# EAGLE design topboard (EAGLE 6.2)
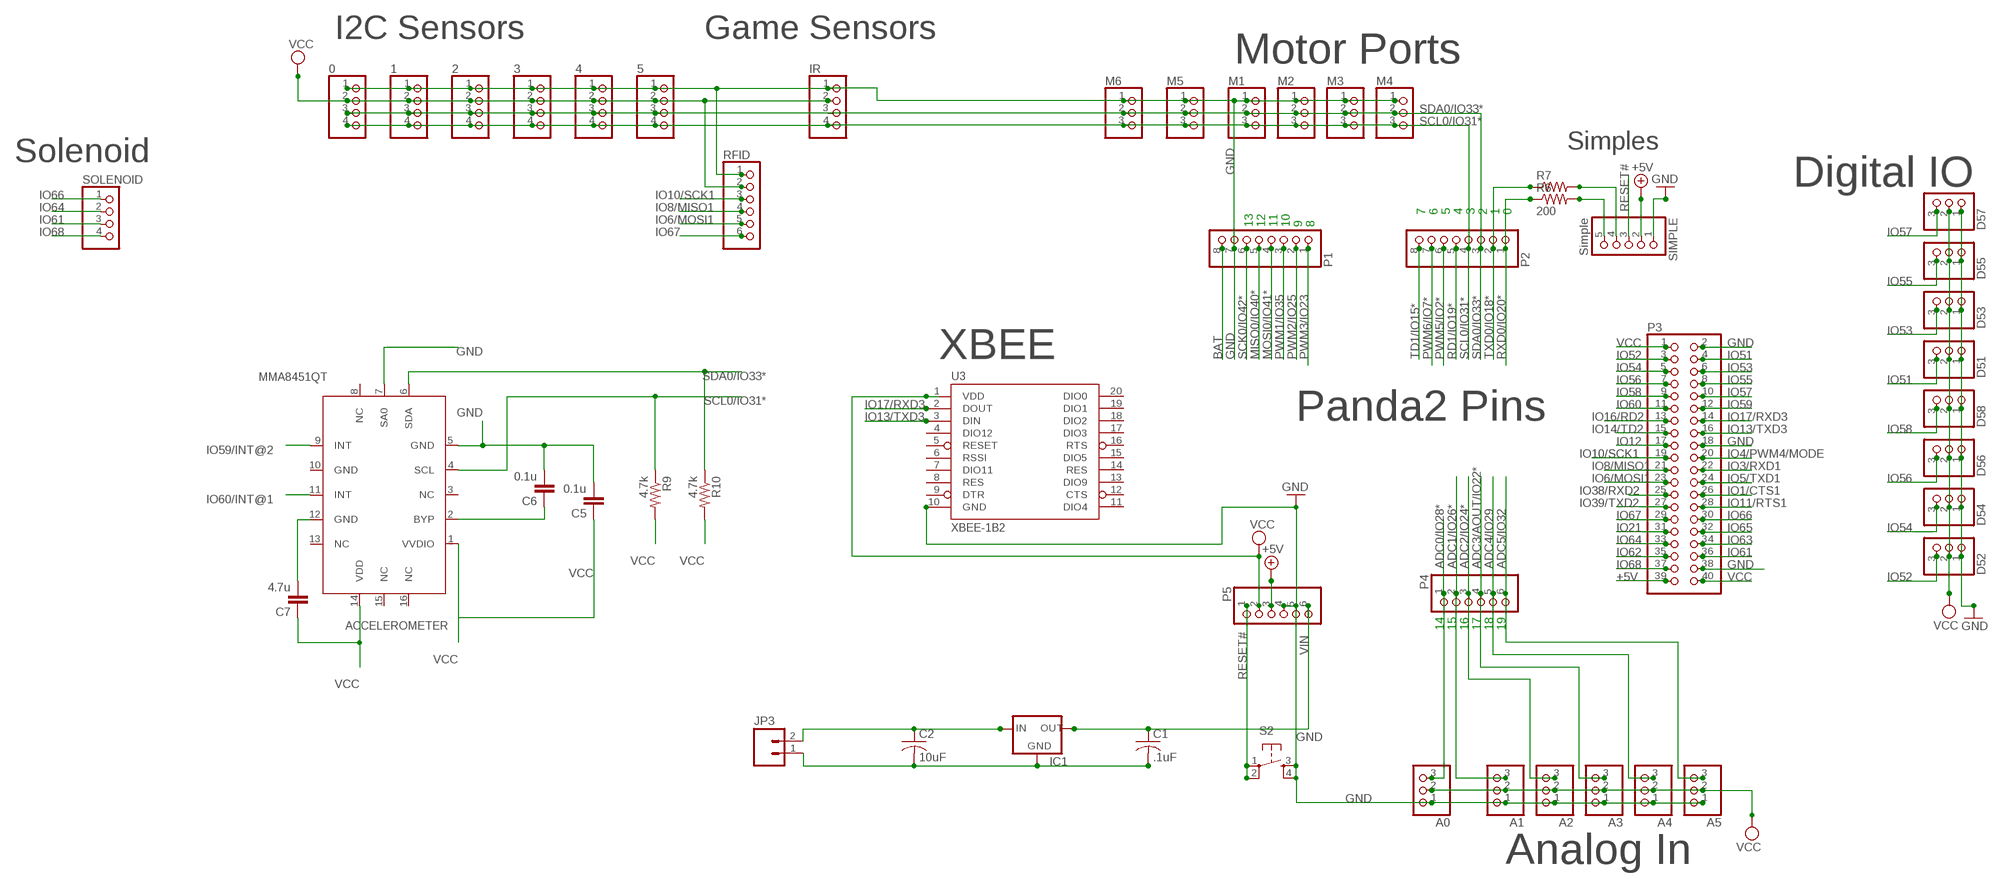
[diagram p0: schematic, sheet 1, part 1 of 2]
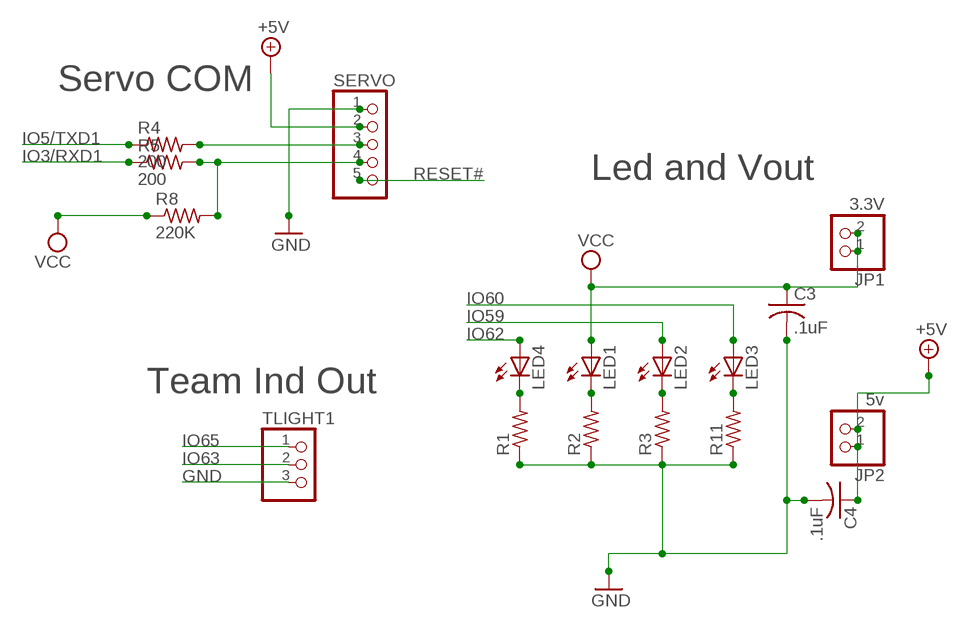
[diagram p1: schematic, sheet 1, part 2 of 2]

## Parts
0  PINHD-1X04_2.54-S  [1X04-S]
1  PINHD-1X04_2.54-S  [1X04-S]
2  PINHD-1X04_2.54-S  [1X04-S]
3  PINHD-1X04_2.54-S  [1X04-S]
4  PINHD-1X04_2.54-S  [1X04-S]
5  PINHD-1X04_2.54-S  [1X04-S]
A0  PINHD-1X03_2.54-S  [1X03-S]
A1  PINHD-1X03_2.54-S  [1X03-S]
A2  PINHD-1X03_2.54-S  [1X03-S]
A3  PINHD-1X03_2.54-S  [1X03-S]
A4  PINHD-1X03_2.54-S  [1X03-S]
A5  PINHD-1X03_2.54-S  [1X03-S]
ACCELEROMETER  MMA8451QT  [MMA8451QT]
C1  .1uF  C-USC0603  [C0603]
C2  10uF  C-USC0805  [C0805]
C3  .1uF  C-USC0603K  [C0603K]
C4  .1uF  C-USC0603K  [C0603K]
C5  0.1u  CAP0603-CAP  [0603-CAP]
C6  0.1u  CAP0603-CAP  [0603-CAP]
C7  4.7u  CAP0603-CAP  [0603-CAP]
D51  PINHD-1X03_2.54-S  [1X03-S]
D52  PINHD-1X03_2.54-S  [1X03-S]
D53  PINHD-1X03_2.54-S  [1X03-S]
D54  PINHD-1X03_2.54-S  [1X03-S]
D55  PINHD-1X03_2.54-S  [1X03-S]
D56  PINHD-1X03_2.54-S  [1X03-S]
D57  PINHD-1X03_2.54-S  [1X03-S]
D58  PINHD-1X03_2.54-S  [1X03-S]
IC1  V_REG_78XXSIDE  [78XXL]
IR  PINHD-1X04_2.54-S  [1X04-S]
JP1  3.3V  PINHD-1X2  [1X02]
JP2  5v  PINHD-1X2  [1X02]
JP3  M02PTH4  [1X02_XTRA_BIG]
LED1  LED0603  [LED-0603]
LED2  LED0603  [LED-0603]
LED3  LED0603  [LED-0603]
LED4  LED0603  [LED-0603]
M1  PINHD-1X03_2.54-S  [1X03-S]
M2  PINHD-1X03_2.54-S  [1X03-S]
M3  PINHD-1X03_2.54-S  [1X03-S]
M4  PINHD-1X03_2.54-S  [1X03-S]
M5  PINHD-1X03_2.54-S  [1X03-S]
M6  PINHD-1X03_2.54-S  [1X03-S]
P1  PINHD-1X08_2.54-S  [1X08-S]
P2  PINHD-1X08_2.54-S  [1X08-S]
P3  PINHD-2X20  [2X20]
P4  PINHD-1X06_2.54-S  [1X06-S]
P5  PINHD-1X06_2.54-S  [1X06-S]
R1  R-US_R0603  [R0603]
R2  R-US_R0603  [R0603]
R3  R-US_R0603  [R0603]
R4  200  R-US_R0603  [R0603]
R5  200  R-US_R0603  [R0603]
R6  200  R-US_R0603  [R0603]
R7  R-US_R0603  [R0603]
R8  220K  R-US_R0603  [R0603]
R9  4.7k  RESISTOR0603-RES  [0603-RES]
R10  4.7k  RESISTOR0603-RES  [0603-RES]
R11  R-US_R0603  [R0603]
RFID  PINHD-1X6  [1X06]
S2  TAC_SWITCHPTH  [TACTILE-PTH]
SERVO  PINHD-1X05_2.54-S  [1X05-S]
SIMPLE  Simple  PINHD-1X05_2.54-S  [1X05-S]
SOLENOID  PINHD-1X4  [1X04]
TLIGHT1  PINHD-1X03_2.54-S  [1X03-S]
U3  XBEE-1B2  [XBEE-SILK]

## Nets
12V: C2.1 IC1.IN JP3.2
+5V [power]: C4.1 JP2.1 JP2.2 P3.39 P5.3 SERVO.2 SIMPLE.2
ADC0/IO28*: A0.3 P4.1
ADC1/IO26*: A1.3 P4.2
ADC2/IO24*: A2.3 P4.3
ADC3/AOUT/IO22*: A3.3 P4.4
ADC4/IO29: A4.3 P4.5
ADC5/IO32: A5.3 P4.6
BAT: P1.8
GND: 0.1 1.1 2.1 3.1 4.1 5.1 A0.1 A1.1 A2.1 A3.1 A4.1 A5.1 ACCELEROMETER.5(GND) ACCELEROMETER.7(SA0) C1.2 C2.2 C3.2 C4.2 C5.2 C6.2 D51.1 D52.1 D53.1 D54.1 D55.1 D56.1 D57.1 D58.1 IC1.GND IC1.P$1(GND) IC1.P$2(GND) IR.1 JP3.1 M1.1 M2.1 M3.1 M4.1 M5.1 M6.1 P1.7 P3.2 P3.18 P3.38 P5.4 P5.5 R1.1 R2.1 R3.1 R11.1 RFID.1 S2.3 S2.4 SERVO.1 SIMPLE.1 TLIGHT1.3 U3.10(GND)
IO1/CTS1: P3.26
IO3/RXD1: P3.22 R5.1
IO4/PWM4/MODE: P3.20
IO5/TXD1: P3.24 R4.1
IO6/MOSI1: P3.23 RFID.5
IO8/MISO1: P3.21 RFID.4
IO10/SCK1: P3.19 RFID.3
IO11/RTS1: P3.28
IO12: P3.17
IO13/TXD3: P3.16 U3.3(DIN)
IO14/TD2: P3.15
IO16/RD2: P3.13
IO17/RXD3: P3.14 U3.2(DOUT)
IO21: P3.31
IO38/RXD2: P3.25
IO39/TXD2: P3.27
IO51: D51.3 P3.4
IO52: D52.3 P3.3
IO53: D53.3 P3.6
IO54: D54.3 P3.5
IO55: D55.3 P3.8
IO56: D56.3 P3.7
IO57: D57.3 P3.10
IO58: D58.3 P3.9
IO59: LED2.A P3.12
IO59/INT@2: ACCELEROMETER.9(INT)
IO60: LED3.A P3.11
IO60/INT@1: ACCELEROMETER.11(INT)
IO61: P3.36 SOLENOID.3
IO62: LED4.A P3.35
IO63: P3.34 TLIGHT1.2
IO64: P3.33 SOLENOID.2
IO65: P3.32 TLIGHT1.1
IO66: P3.30 SOLENOID.1
IO67: P3.29 RFID.6
IO68: P3.37 SOLENOID.4
MISO0/IO40*: P1.5
MOSI0/IO41*: P1.4
N$1: LED4.C R1.2
N$2: LED1.C R2.2
N$3: LED2.C R3.2
N$4: R6.2 SIMPLE.5
N$5: R4.2 SERVO.3
N$6: R7.2 SIMPLE.4
N$7: R5.2 R8.2 SERVO.4
N$8: LED3.C R11.2
N$9: ACCELEROMETER.12(GND) C7.2
N$10: ACCELEROMETER.2(BYP) C6.1
PWM1/IO35: P1.3
PWM2/IO25: P1.2
PWM3/IO23: P1.1
PWM5/IO2*: P2.6
PWM6/IO7*: P2.7
RD1/IO19*: P2.5
RESET#: P5.1 S2.1 S2.2 SERVO.5 SIMPLE.3
RXD0/IO20*: P2.1 R6.1
SCK0/IO42*: P1.6
SCL0/IO31*: 0.4 1.4 2.4 3.4 4.4 5.4 ACCELEROMETER.4(SCL) IR.4 M1.3 M2.3 M3.3 M4.3 M5.3 M6.3 P2.4 R9.1
SDA0/IO33*: 0.3 1.3 2.3 3.3 4.3 5.3 ACCELEROMETER.6(SDA) IR.3 M1.2 M2.2 M3.2 M4.2 M5.2 M6.2 P2.3 R10.1
TD1/IO15*: P2.8
TXD0/IO18*: P2.2 R7.1
VCC [power]: 0.2 1.2 2.2 3.2 4.2 5.2 A0.2 A1.2 A2.2 A3.2 A4.2 A5.2 ACCELEROMETER.1(VVDIO) ACCELEROMETER.14(VDD) C3.1 C5.1 C7.1 D51.2 D52.2 D53.2 D54.2 D55.2 D56.2 D57.2 D58.2 IR.2 JP1.1 JP1.2 LED1.A P3.1 P3.40 P5.2 R8.1 R9.2 R10.2 RFID.2 U3.1(VDD)
VIN: C1.1 IC1.OUT P5.6
Unconnected: ACCELEROMETER.3(NC) ACCELEROMETER.8(NC) ACCELEROMETER.10(GND) ACCELEROMETER.13(NC) ACCELEROMETER.15(NC) ACCELEROMETER.16(NC) U3.4(DIO12) U3.5(RESET) U3.6(RSSI) U3.7(DIO11) U3.8(RES) U3.9(DTR) U3.11(DIO4) U3.12(CTS) U3.13(DIO9) U3.14(RES) U3.15(DIO5) U3.16(RTS) U3.17(DIO3) U3.18(DIO2) U3.19(DIO1) U3.20(DIO0)

## Notes on the sheet
- I2C Sensors | Game Sensors
- Motor Ports
- Simples
- Solenoid
- Digital IO
- 7 | 6 | 5 | 4 | 3 | 2 | 1 | 0
- 13 | 12 | 11 | 10 | 9 | 8 | Servo COM
- Led and Vout
- XBEE
- Panda2 Pins
- Team Ind Out
- 14 | 15 | 16 | 17 | 18 | 19
- Analog In

## Library data of the parts
0 1-5 IR = pinhead-2:PINHD-1X04: PIN HEADER
A0 A1-A5 D51-D58 M1-M6 TLIGHT1 = pinhead-2:PINHD-1X03: PIN HEADER
ACCELEROMETER = MMA8451QT:MMA8451QT
C1-C4 = rcl:C-US: CAPACITOR, American symbol
C5-C7 = SparkFun:CAP: Capacitor Standard 0603 ceramic capacitor, and 0.1" leaded capacitor.
IC1 = SparkFun:V_REG_78XX: Voltage Regulator Standard 7805 5V regulator. IGO (Input Ground Output). Spark Fun Electronics SKU : COM-00107
JP1 JP2 = pinhead:PINHD-1X2: PIN HEADER
JP3 = SparkFun:M02: Header 2 Standard 2-pin 0.1" header. Use with straight break away headers (SKU : PRT-00116), right angle break away headers (PRT-00553), swiss pins (PRT-00743), machine pins (PRT-00117), and female headers (PRT-00115). Molex polarized connector foot print use with SKU : PRT-08233 with associated crimp pins and housings.
LED1-LED4 = SparkFun:LED: LEDs Standard schematic elements and footprints for 5mm, 3mm, 1206, and 0603 sized LEDs. 5mm - Spark Fun Electronics SKU : COM-00529 (and others)
P1 P2 = pinhead-2:PINHD-1X08: PIN HEADER
P3 = pinhead:PINHD-2X20: PIN HEADER
P4 P5 = pinhead-2:PINHD-1X06: PIN HEADER
R1-R8 R11 = rcl:R-US_: RESISTOR, American symbol
R9 R10 = SparkFun:RESISTOR: Resistor Basic schematic elements and footprints for 0603, 1206, and PTH resistors.
RFID = pinhead:PINHD-1X6: PIN HEADER
S2 = SparkFun:TAC_SWITCH: Momentary Switch Button commonly used for reset or general input. Spark Fun Electronics SKU : COM-00097
SERVO SIMPLE = pinhead-2:PINHD-1X05: PIN HEADER
SOLENOID = pinhead:PINHD-1X4: PIN HEADER
U3 = SparkFun:XBEE-1

## Net classes
1 power: width 0.406 mm, drill 0.381 mm, clearance 0.203 mm

## Board
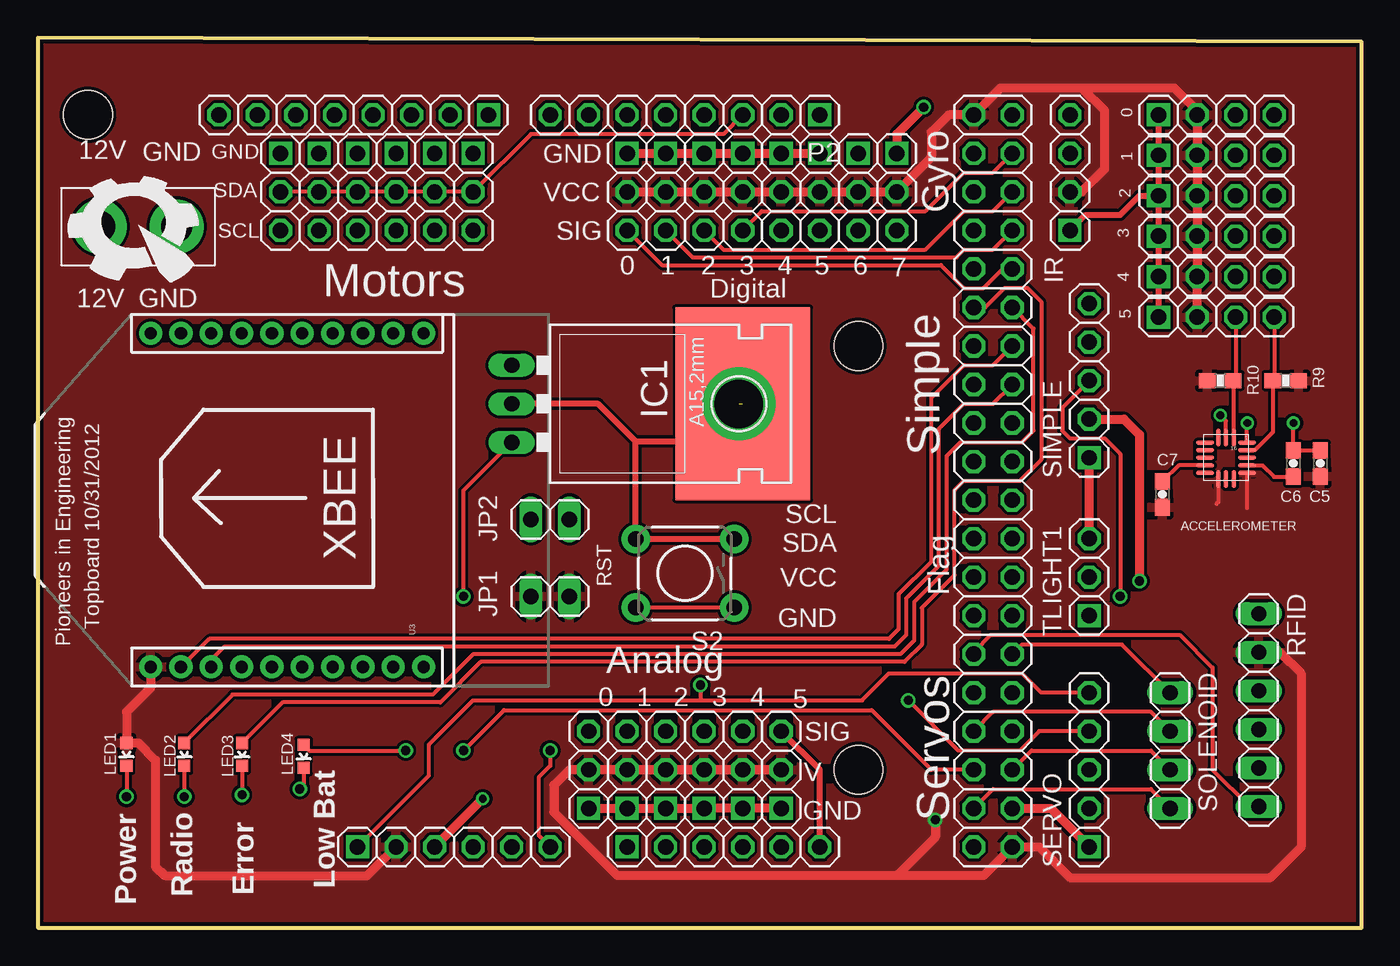
[diagram p2: board, top side]
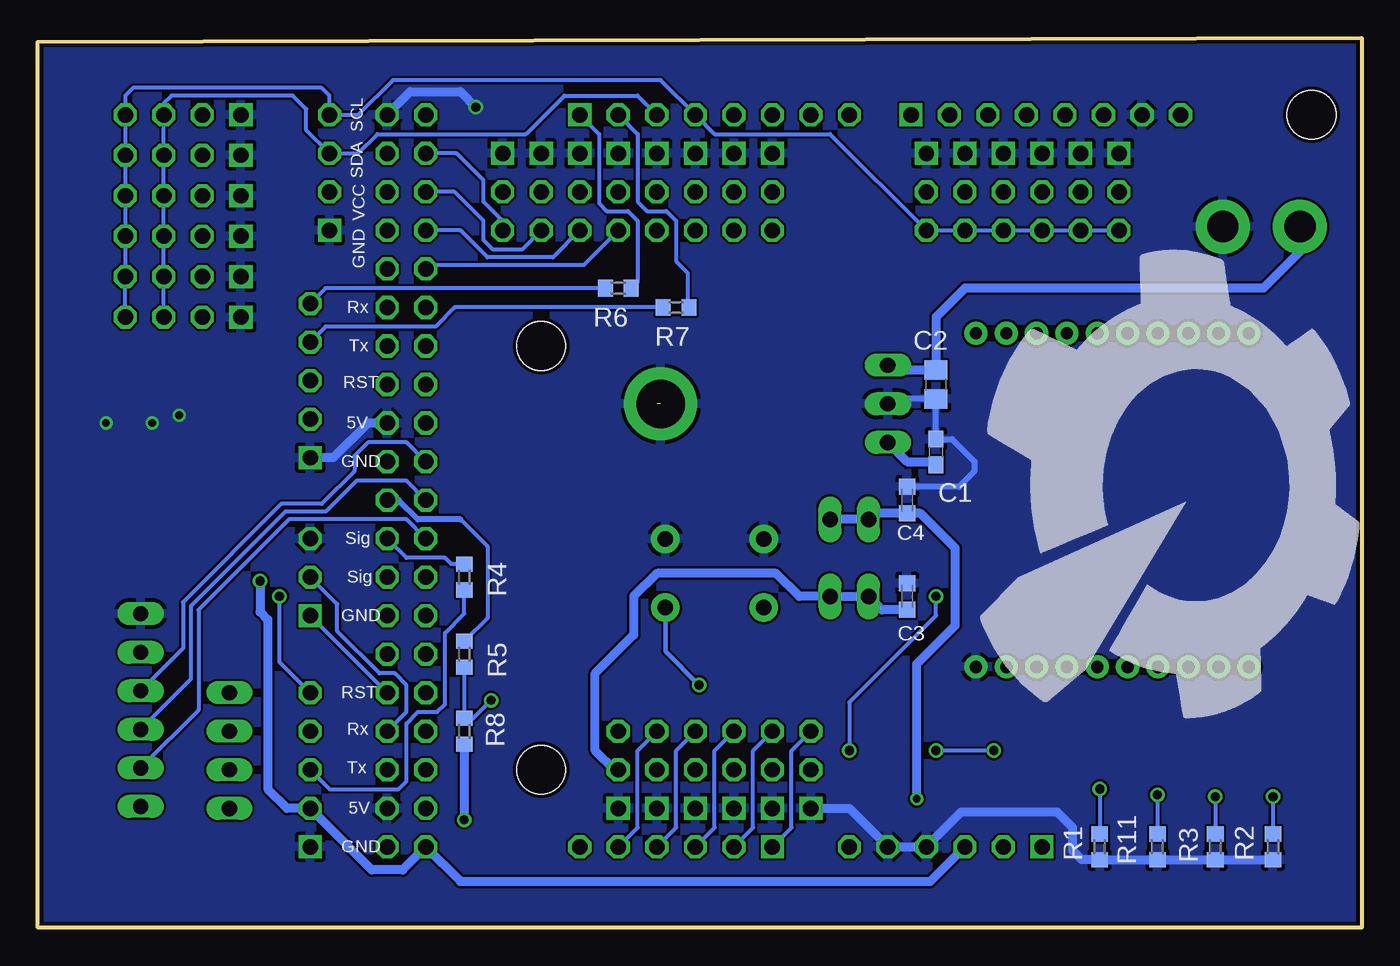
[diagram p3: board, bottom side, seen from below]

Size 87.3 x 58.66 mm. Coordinates in mm from the lower left corner, seen from the top.
Outline: 0,0 87.3,0 87.3,58.41 0,58.66 0,0
Copper layers (1*16): Top 2mil / dielectric 9mil / Bottom 2mil
Design rules: minimum track width 6mil, minimum drill 15mil, track to track 6mil, track to pad 10mil, pad to pad 6mil, via to via 6mil, smd to smd 6mil, copper to edge 10mil, drill to drill 7mil, minimum pad ring 7mil, minimum via ring 7mil, stop-mask expansion 3mil, vias tented up to drill 0mil, thermal gap 10mil
Holes 3.2 mm at 3.3,53.59 54.1,38.35 54.1,10.41

### Footprints (pad centres in the part's own frame; a part is rotated, then mirrored left to right if it is on the bottom)
1X04-S = drill 1.016 square: 1 -3.81,0 | drill 1.016 octagon: 2 -1.27,0; 3 1.27,0; 4 3.81,0
1X03-S = drill 1.016 square: 1 -2.54,0 | drill 1.016 octagon: 2 0,0; 3 2.54,0
MMA8451QT = smd 1.177 x 0.25: 1 -1.38,1; 2 -1.38,0.5; 3 -1.38,0; 4 -1.38,-0.5; 5 -1.38,-1; 9 1.395,-1; 10 1.395,-0.5; 11 1.395,0; 12 1.395,0.5; 13 1.395,1 | smd 0.3 x 1.177: 6 -0.5,-1.341; 7 0,-1.341; 8 0.5,-1.341; 14 0.5,1.405; 15 0,1.405; 16 -0.5,1.405
C0603 = smd 1.1 x 1: 1 -0.85,0; 2 0.85,0
C0805 = smd 1.3 x 1.5: 1 -0.95,0; 2 0.95,0
C0603K = smd 1.05 x 1.08: 1 -0.875,0; 2 0.875,0
0603-CAP = smd 1.1 x 1: 1 -0.85,0; 2 0.85,0
78XXL = drill 1.016 long: GND 0,-3.81; IN -2.54,-3.81; OUT 2.54,-3.81 | smd 12.7 x 8.89: P$1 0,11.43 | drill 3.2: P$2 0,11.176
1X02 = drill 1.016 long: 1 -1.27,0; 2 1.27,0
1X02_XTRA_BIG = drill 2.057 pad 3.556: 1 -2.54,0; 2 2.54,0
LED-0603 = smd 0.8 x 0.8: A 0,-0.75; C 0,0.75
1X08-S = drill 1.016 square: 1 -8.89,0 | drill 1.016 octagon: 2 -6.35,0; 3 -3.81,0; 4 -1.27,0; 5 1.27,0; 6 3.81,0; 7 6.35,0; 8 8.89,0
2X20 = drill 1.016 octagon: 1 -24.13,-1.27; 2 -24.13,1.27; 3 -21.59,-1.27; 4 -21.59,1.27; 5 -19.05,-1.27; 6 -19.05,1.27; 7 -16.51,-1.27; 8 -16.51,1.27; 9 -13.97,-1.27; 10 -13.97,1.27; 11 -11.43,-1.27; 12 -11.43,1.27; 13 -8.89,-1.27; 14 -8.89,1.27; 15 -6.35,-1.27; 16 -6.35,1.27; 17 -3.81,-1.27; 18 -3.81,1.27; 19 -1.27,-1.27; 20 -1.27,1.27; 21 1.27,-1.27; 22 1.27,1.27; 23 3.81,-1.27; 24 3.81,1.27; 25 6.35,-1.27; 26 6.35,1.27; 27 8.89,-1.27; 28 8.89,1.27; 29 11.43,-1.27; 30 11.43,1.27; 31 13.97,-1.27; 32 13.97,1.27; 33 16.51,-1.27; 34 16.51,1.27; 35 19.05,-1.27; 36 19.05,1.27; 37 21.59,-1.27; 38 21.59,1.27; 39 24.13,-1.27; 40 24.13,1.27
1X06-S = drill 1.016 square: 1 -6.35,0 | drill 1.016 octagon: 2 -3.81,0; 3 -1.27,0; 4 1.27,0; 5 3.81,0; 6 6.35,0
R0603 = smd 1 x 1.1: 1 -0.85,0; 2 0.85,0
0603-RES = smd 1.1 x 1: 1 -0.85,0; 2 0.85,0
1X06 = drill 1.016 long: 1 -6.35,0; 2 -3.81,0; 3 -1.27,0; 4 1.27,0; 5 3.81,0; 6 6.35,0
TACTILE-PTH = drill 1.016 pad 1.88: 1 -3.251,2.261; 2 3.251,2.261; 3 -3.251,-2.261; 4 3.251,-2.261
1X05-S = drill 1.016 square: 1 -5.08,0 | drill 1.016 octagon: 2 -2.54,0; 3 0,0; 4 2.54,0; 5 5.08,0
1X04 = drill 1.016 long: 1 -3.81,0; 2 -1.27,0; 3 1.27,0; 4 3.81,0
XBEE-SILK = drill 0.8 pad 1.524: 1 -11,20; 2 -11,18; 3 -11,16; 4 -11,14; 5 -11,12; 6 -11,10; 7 -11,8; 8 -11,6; 9 -11,4; 10 -11,2; 11 11,2; 12 11,4; 13 11,6; 14 11,8; 15 11,10; 16 11,12; 17 11,14; 18 11,16; 19 11,18; 20 11,20

### Placement (x,y rotation side)
0  77.72,53.59 0 top
1  77.72,50.93 0 top
2  77.72,48.26 0 top
3  77.72,45.59 0 top
4  77.72,42.93 0 top
5  77.72,40.26 0 top
A0  36.32,10.41 90 top
A1  38.86,10.41 90 top
A2  41.4,10.41 90 top
A3  43.94,10.41 90 top
A4  46.48,10.41 90 top
A5  49.02,10.41 90 top
ACCELEROMETER  78.36,30.99 180 top
C1  28.07,31.37 90 bottom
C2  28.07,35.81 270 bottom
C3  29.97,21.84 90 bottom
C4  29.97,28.19 90 bottom
C5  84.58,30.61 90 top
C6  82.8,30.61 90 top
C7  74.17,28.57 90 top
D51  46.48,48.51 270 top
D52  56.64,48.51 270 top
D53  43.94,48.51 270 top
D54  54.1,48.51 270 top
D55  41.4,48.51 270 top
D56  51.56,48.51 270 top
D57  38.86,48.51 270 top
D58  49.02,48.51 270 top
IC1  35.05,34.54 270 top
IR  68.07,49.78 90 top
JP1  33.78,21.84 0 top
JP2  33.78,26.92 0 top
JP3  6.6,46.23 180 top
LED1  5.84,11.43 180 top
LED2  9.65,11.43 180 top
LED3  13.46,11.43 180 top
LED4  17.53,11.3 180 top
M1  21.08,48.51 270 top
M2  23.62,48.51 270 top
M3  26.16,48.51 270 top
M4  28.7,48.51 270 top
M5  18.54,48.51 270 top
M6  16,48.51 270 top
P1  20.83,53.59 180 top
P2  42.67,53.59 180 top
P3  62.99,29.46 270 top
P4  45.21,5.33 0 top
P5  27.43,5.33 0 top
R1  17.27,5.33 90 bottom
R2  5.84,5.33 90 bottom
R3  9.65,5.33 90 bottom
R4  59.18,23.11 270 bottom
R5  59.18,18.03 270 bottom
R6  49.02,42.16 180 bottom
R7  45.21,40.89 180 bottom
R8  59.18,12.95 90 bottom
R9  82.3,36.07 0 top
R10  77.98,36.07 180 top
R11  13.46,5.33 90 bottom
RFID  80.52,14.35 270 top
S2  42.67,23.37 180 top
SERVO  69.34,10.41 90 top
SIMPLE  69.34,36.07 90 top
SOLENOID  74.68,11.68 270 top
TLIGHT1  69.34,23.11 90 top
U3  27.43,28.19 90 top
U$2  [PIE-LOGO]  11.81,28.19 270 bottom
U$3  [PIE-LOGO-SMALL]  6.6,46.35 0 top

### Tracks (layer width: path | path; a pad name or v marks a point on that pad's centre or on a via)
12V
  Bottom 0.61: IC1.IN 30.92,36.76 C2.1 28.07,40.26 26.16,42.16 6.48,42.16 4.06,44.58 JP3.2
+5V  (via drill 0.51, 0.6 pad 0.25)
  Top 0.61: SIMPLE.2 71.63,33.53 72.64,32.51 v72.64,22.86 | v29.34,8.51 P5.3
  Bottom 0.61: JP2.2 JP2.1 32.12,27.32 C4.1 29.1,27.32 26.8,25.02 26.8,19.94 29.34,17.4 v29.34,8.51 | v72.64,22.86 72.64,20.83 72.14,20.32 72.14,9.14 70.87,7.87 SERVO.2 65.28,3.81 63.25,3.81 P3.39 59.44,3.05 28.45,3.05 P5.3
ADC0/IO28*
  Bottom 0.254: P4.1 37.59,6.6 37.59,11.68 A0.3
ADC1/IO26*
  Bottom 0.254: P4.2 40.13,6.6 40.13,11.68 A1.3
ADC2/IO24*
  Bottom 0.254: P4.3 42.67,6.6 42.67,11.68 A2.3
ADC3/AOUT/IO22*
  Bottom 0.254: P4.4 45.21,6.6 45.21,11.68 A3.3
ADC4/IO29
  Bottom 0.254: P4.5 47.75,6.6 47.75,11.68 A4.3
ADC5/IO32
  Top 0.406: P4.6 51.56,10.41 A5.3
GND  (via drill 0.51, 0.6 pad 0.25)  (1 unrouted)
  Top 0.254: C5.2 C6.2 v82.8,33.27 | ACCELEROMETER.7 78.36,33.4 v77.98,33.78 | ACCELEROMETER.5 79.74,33.26 v79.76,33.27
  Top 0.406: 39.42,32.08 S2.4 S2.3 | 39.42,32.08 36.96,34.54 IC1.GND | 39.42,32.08 43.76,32.08 IC1.P$2 | IR.1 69.09,46.99 71.37,46.99 72.64,48.26 2.1 | 5.1 4.1 3.1 2.1 | 2.1 1.1 0.1
  Top 0.61: v58.42,54.1 56.64,52.32 D52.1 | P3.38 66.8,7.87 SERVO.1 | A0.1 A1.1 A2.1 A3.1 A4.1 A5.1 | D57.1 D58.1 D56.1 | TLIGHT1.3 SIMPLE.1
  Bottom 0.406: IC1.GND 30.92,34.86 C2.2 C1.2 27.01,32.22 25.53,30.73 25.53,30.1 26.56,29.07 C4.2
  Bottom 0.61: P3.18 65.53,33.27 67.82,30.99 SIMPLE.1 | R2.1 R3.1 R11.1 R1.1 18.45,4.48 19.05,5.08 19.05,6.6 20.07,7.62 26.42,7.62 P5.4 P5.5 33.78,7.87 A0.1 | P3.2 62.74,55.12 59.44,55.12 v58.42,54.1
  pour Bottom: 0,0.38 87.38,0 87.76,58.42 0,58.67
IO3/RXD1
  Bottom 0.254: 59.44,26.92 57.66,25.15 57.66,20.41 R5.1
  Bottom 0.406: 59.44,26.92 62.23,26.92 63.5,28.19 P3.22
IO5/TXD1
  Bottom 0.254: P3.24 62.99,24.38 60.45,24.38 60.03,23.96 R4.1
IO6/MOSI1
  Bottom 0.254: P3.23 62.99,26.92 70.74,26.92 76.71,20.96 76.71,14.35 RFID.5
IO8/MISO1
  Bottom 0.254: P3.21 62.99,29.46 66.29,29.46 68.33,27.43 70.99,27.43 77.22,21.21 77.22,16.38 RFID.4
IO10/SCK1
  Bottom 0.254: P3.19 62.99,32 65.53,32 66.42,31.12 66.42,30.1 68.58,27.94 71.25,27.94 77.72,21.46 77.72,18.41 RFID.3
IO13/TXD3
  Top 0.254: U3.3 11.43,17.66 12.32,18.54 56.52,18.54 57.28,19.3 57.28,21.72 59.44,23.88 59.44,32.89 61.09,34.54 62.99,34.54 P3.16
IO17/RXD3
  Top 0.254: U3.2 9.45,17.19 11.3,19.05 56.13,19.05 56.77,19.68 56.77,21.97 58.93,24.13 58.93,34.92 61.09,37.08 62.99,37.08 P3.14
IO51
  Top 0.254: D51.3 47.75,47.24 58.55,47.24 61.09,49.78 62.99,49.78 P3.4
IO52
  Bottom 0.254: D52.3 56.64,46.61 57.91,47.88 57.91,49.28 59.69,51.05 P3.3
IO53
  Top 0.254: D53.3 45.21,44.7 58.55,44.7 61.09,47.24 62.99,47.24 P3.6
IO54
  Bottom 0.254: D54.3 55.37,44.7 57.28,44.7 57.91,45.34 57.91,46.61 59.82,48.51 P3.5
IO55
  Top 0.254: D55.3 43.18,44.2 60.58,44.2 61.09,44.7 62.99,44.7 P3.8
IO56
  Bottom 0.254: D56.3 53.34,44.2 57.66,44.2 59.44,45.97 P3.7
IO57
  Top 0.254: D57.3 41.15,43.69 59.56,43.69 61.09,42.16 62.36,42.16 63.63,43.43 P3.10
IO58
  Bottom 0.254: D58.3 51.31,43.69 61.47,43.69 P3.9
IO59
  Top 0.254: P3.12 65.66,39.5 65.66,32.77 64.9,32 60.83,32 59.94,31.12 59.94,23.62 57.78,21.46 57.78,18.92 56.9,18.03 28.7,18.03 26.03,15.37 12.84,15.37 LED2.A
IO60
  Top 0.254: P3.11 62.48,40.89 63.75,42.16 65.28,42.16 66.17,41.27 66.17,30.86 64.77,29.46 61.09,29.46 60.45,28.83 60.45,23.24 58.29,21.08 58.29,18.67 57.15,17.53 29.21,17.53 26.54,14.86 16.14,14.86 LED3.A 13.47,12.19
IO61
  Top 0.254: P3.36 65.53,11.68 73.41,11.68 SOLENOID.3
IO62  (via drill 0.6)
  Top 0.254: P3.35 58.93,10.41 54.99,14.35 30.73,14.35 v28.07,11.68 | LED4.A 17.89,11.68 v24.26,11.68
  Bottom 0.254: v24.26,11.68 v28.07,11.68
IO63
  Bottom 0.254: P3.34 62.99,14.22 62.99,16 63.75,16.76 64.77,16.76 67.56,19.56 67.56,21.34 TLIGHT1.2
IO64
  Top 0.254: SOLENOID.2 73.41,14.22 62.99,14.22 P3.33
IO65
  Bottom 0.254: P3.32 TLIGHT1.1
IO66
  Top 0.254: SOLENOID.1 71.5,18.67 64.9,18.67 P3.30
IO67
  Top 0.254: P3.29 61.72,18.16 62.86,19.3 75.31,19.3 77.47,17.14 77.47,10.41 79.88,8 RFID.6
IO68
  Top 0.254: SOLENOID.4 73.41,9.14 62.99,9.14 P3.37
N$1  (via drill 0.6)
  Top 0.254: LED4.C 17.53,9.4 v17.27,9.14
  Bottom 0.254: v17.27,9.14 R1.2
N$2  (via drill 0.6)
  Top 0.254: LED1.C v5.84,8.64
  Bottom 0.254: v5.84,8.64 R2.2
N$3  (via drill 0.6)
  Top 0.254: LED2.C v9.65,8.64
  Bottom 0.254: v9.65,8.64 R3.2
N$4
  Bottom 0.254: R6.2 68.33,42.16 SIMPLE.5
N$5
  Bottom 0.254: R4.2 59.18,20.7 60.45,19.43 60.45,14.73 60.96,14.22 62.23,14.22 62.99,13.46 62.99,9.65 63.5,9.14 68.07,9.14 SERVO.3
N$6
  Bottom 0.254: R7.2 59.82,40.89 61.09,39.62 68.33,39.62 SIMPLE.4
N$7  (via drill 0.6 pad 0.25)
  Top 0.254: SERVO.4 66.04,12.95 64.77,11.68 60.71,11.68 v57.4,14.99
  Bottom 0.254: R5.2 R8.2 58.59,13.8 v57.4,14.99
N$8  (via drill 0.6)
  Top 0.254: LED3.C v13.46,8.76
  Bottom 0.254: v13.46,8.76 R11.2
N$9
  Top 0.254: ACCELEROMETER.12 75.23,30.49 C7.2
N$10
  Top 0.254: ACCELEROMETER.2 80.76,30.49 81.53,29.72 82.77,29.72 C6.1
RESET#  (via drill 0.6 pad 0.25)
  Top 0.254: S2.1 S2.2 | 43.69,14.99 28.7,14.99 25.78,12.07 25.78,10.03 P5.1 | 43.69,14.99 54.36,14.99 56.13,16.76 64.9,16.76 66.17,15.49 SERVO.5 | v43.69,16 43.69,14.99 | SIMPLE.3 67.56,34.29 67.56,32.77 68.07,32.26 70.36,32.26 71.37,31.24 v71.37,21.84
  Bottom 0.254: v71.37,21.84 71.37,17.53 SERVO.5
  Bottom 0.305: S2.1 45.92,18.24 v43.69,16
RXD0/IO20*
  Bottom 0.254: P2.1 50.29,52.32 50.29,47.75 49.78,47.24 48.39,47.24 47.75,46.61 47.75,42.58 R6.1
SCL0/IO31*
  Top 0.254: 5.4 81.53,36.16 R9.1 81.45,32.68 80.26,31.5 79.75,31.5 ACCELEROMETER.4
  Bottom 0.254: M6.3 M5.3 M1.3 M2.3 M3.3 M4.3 35.05,52.32 42.67,52.32 P2.4 46.23,55.88 63.88,55.88 66.17,53.59 IR.4 68.07,54.86 68.58,55.37 81.03,55.37 81.53,54.86 0.4 1.4 2.4 3.4 4.4 5.4
SDA0/IO33*
  Top 0.254: P2.3 45.21,52.32 32.51,52.32 M4.2 M3.2 M2.2 M1.2 M5.2 M6.2 | 5.3 78.99,36.23 R10.1 78.86,36.04 ACCELEROMETER.6
  Bottom 0.254: P2.3 47.75,54.86 52.58,54.86 55.12,52.32 64.9,52.32 66.17,51.05 IR.3 69.6,52.58 69.6,53.97 70.48,54.86 78.49,54.86 78.99,54.36 0.3 1.3 2.3 3.3 4.3 5.3
TXD0/IO18*
  Bottom 0.254: R7.1 44.45,40.98 44.45,43.18 45.21,43.94 45.21,46.61 45.85,47.24 47.12,47.24 47.75,47.88 47.75,52.32 P2.2
VCC  (via drill 0.6 pad 0.25)
  Top 0.254: ACCELEROMETER.1 79.74,27.7 79.76,27.69 | ACCELEROMETER.14 77.86,28.07 77.72,27.94
  Top 0.61: D57.2 D55.2 D53.2 D51.2 D58.2 D56.2 D54.2 D52.2 58.93,50.8 58.93,52.45 60.07,53.59 P3.1 63.5,55.37 68.83,55.37 | A1.2 A2.2 A3.2 A4.2 A5.2 | A1.2 A0.2 | 5.2 4.2 3.2 2.2 1.2 0.2 76.45,53.85 74.93,55.37 68.83,55.37 | U3.1 7.43,15.81 5.84,14.22 LED1.A 6.62,12.18 7.75,11.05 7.75,4.06 8.38,3.43 21.72,3.43 P5.2 | 56.64,3.43 62.36,3.43 P3.40 66.04,5.33 68.07,3.3 81.28,3.3 83.31,5.33 83.31,16.76 81.91,18.16 RFID.2 | 56.64,3.43 38.23,3.43 34.04,7.62 34.04,9.4 35.05,10.41 A0.2 | A1.2 A5.2 | A5.2 A0.2 | v59.18,7.11 59.18,5.97 56.64,3.43 | 68.83,55.37 70.36,53.85 70.36,50.04 68.83,48.51 IR.2
  Bottom 0.61: P3.40 64.26,5.46 | A5.2 49.28,10.41 50.55,11.68 50.55,16.76 48.01,19.3 48.01,21.84 46.48,23.37 38.61,23.37 37.08,21.84 JP1.2 JP1.1 31.62,20.96 29.99,20.96 C3.1 | R8.1 v59.18,7.11
  pour Top: 0,0.25 87.38,-0.13 87.5,58.17 0,58.42
VIN  (via drill 0.6, 0.6 pad 0.25)
  Top 0.254: v28.07,21.84 28.07,28.83 IC1.OUT | v33.78,11.68 33.78,10.67 33.02,9.91 33.02,6.1 P5.6
  Bottom 0.254: v28.07,21.84 28.07,20.57 33.78,14.86 v33.78,11.68
  Bottom 0.61: IC1.OUT 29.97,30.73 28.28,30.73 C1.1

### Text on the board
tPlace: Gyro | 12V | GND | GND | GND | SDA | VCC | SCL | SIG | 0 | 1 | 2 | 3 | 4 | 5 | 6 | Motors | 7 | 12V | GND | Digital | Simple | SCL | SDA | Flag | XBEE | VCC | RST | GND | Topboard 10/31/2012 | Pioneers in Engineering | Analog | Servos | 0 | 1 | 2 | 3 | 4 | 5 | SIG | Low Bat | V | GND | Radio | Power | Error
bPlace: SCL | SDA | VCC | GND | Rx | Tx | RST | 5V | GND | Sig | Sig | GND | RST | Rx | Tx | 5V | GND